# EAGLE design v1.1 Power (EAGLE 9.7.0)
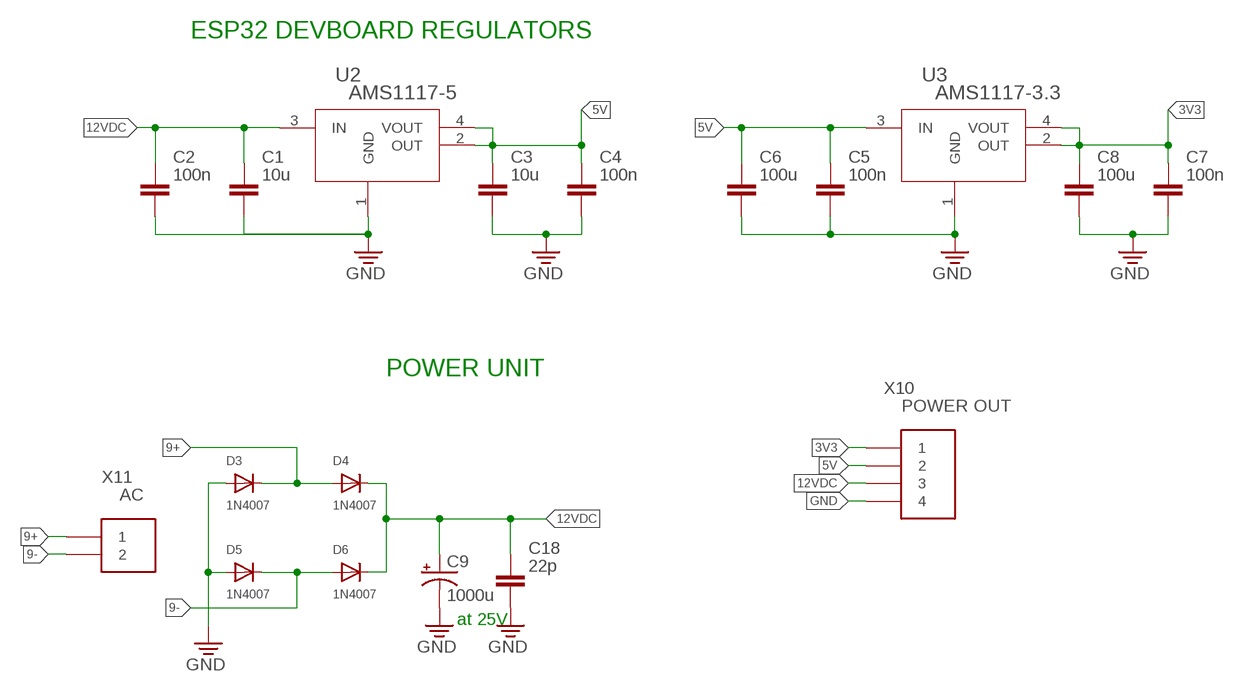
[diagram p0: schematic, sheet 1]

## Parts
C1  10u  C_CHIP-0805(2012-METRIC)  [CAPC2012X110]
C2  100n  C_CHIP-0805(2012-METRIC)  [CAPC2012X110]
C3  10u  C_CHIP-0805(2012-METRIC)  [CAPC2012X110]
C4  100n  C_CHIP-0805(2012-METRIC)  [CAPC2012X110]
C5  100n  C_CHIP-0805(2012-METRIC)  [CAPC2012X110]
C6  100u  C_CHIP-0805(2012-METRIC)  [CAPC2012X110]
C7  100n  C_CHIP-0805(2012-METRIC)  [CAPC2012X110]
C8  100u  C_CHIP-0805(2012-METRIC)  [CAPC2012X110]
C9  1000u  CAP_10X20INCAP_10X20IN  [CAP_10X20IN]
C18  22p  C_CHIP-0805(2012-METRIC)  [CAPC2012X110]
D3  1N4007  DIODE_SOD-123FL  [SOD-123FL]
D4  1N4007  DIODE_SOD-123FL  [SOD-123FL]
D5  1N4007  DIODE_SOD-123FL  [SOD-123FL]
D6  1N4007  DIODE_SOD-123FL  [SOD-123FL]
U2  AMS1117-5  AMS1117-5.0_AMS-L  [_AMS-L]
U3  AMS1117-3.3  AMS1117-3.3_ADS-L  [_ADS-L]
X10  POWER OUT  JST-XH-04-PIN-LONG-PAD  [JST-XH-04-PACKAGE-LONG-PAD]
X11  AC  JST-XH-02-PIN-LONG-PAD  [-LONG-PAD]

## Nets
3V3: C7.1 C8.1 U3.2(OUT) U3.4(VOUT) X10.1
5V: C3.1 C4.1 C5.1 C6.1 U2.2(OUT) U2.4(VOUT) U3.3(IN) X10.2
9+: D3.C D4.A X11.1
9-: D5.C D6.A X11.2
12VDC: C1.1 C2.1 C9.1(+) C18.1 D4.C D6.C U2.3(IN) X10.3
GND: C1.2 C2.2 C3.2 C4.2 C5.2 C6.2 C7.2 C8.2 C9.2(-) C18.2 D3.A D5.A U2.1(GND) U3.1(GND) X10.4

## Notes on the sheet
- ESP32 DEVBOARD REGULATORS
- POWER UNIT
- at 25V

## Library data of the parts
C1-C8 C18 = Capacitor:C: Capacitor - Generic; CATEGORY: Capacitor
C9 = SD-SolderSync-Library:CAP_10X20IN; COPYRIGHT: Copyright (C) 2025 Ultra Librarian. All rights reserved.; MANUFACTURER_PART_NUMBER: UVR1E102MPD; MFR_NAME: Nichicon
D3-D6 = adafruit:DIODE: Diode SMADIODE - SMA Surface Mount Package 20V 1A Schottky Diode Digikey: 641-1014-6-ND DO-1N4148 - Through Hole Small Current Diode SOD-123 20V 1 A (.5mV Vf) Schottky Diode - Digikey: MBRX120TPMSCT-ND SOD-323 10V 570mA (.38mV Vf, 3ns) Schottky Diode - Digikey: ZLLS410CT-ND SOD-523 30V 30mA Schottky Diode (RB751S-40TE61) - Digikey: RB751S-40TE61CT-ND SOT23-R/W - SOT23 Package (R = Solder Paste/Reflow Ovens, W = Hand-Soldering) BAT54Film 40V 300mA - Digikey: 497-7162-1-ND
U2 = SD-SolderSync-Library:AMS1117-5.0; COPYRIGHT: Copyright (C) 2024 Ultra Librarian. All rights reserved.; MANUFACTURER_PART_NUMBER: AMS1117-5.0; MFR_NAME: ams OSRAM
U3 = SD-SolderSync-Library:AMS1117-3.3; COPYRIGHT: Copyright (C) 2024 Ultra Librarian. All rights reserved.; MANUFACTURER_PART_NUMBER: AMS1117-3.3; MFR_NAME: Advanced Monolithic Systems
X10 = Connectors:JST-XH-04-PIN: JST XH Connector 2 Pin Wire to board connector. Pitch: 2,54 mm, (0.100") Number of pins: 4 Created by Rembrandt Electronics www.rembrandtelectronics.com
X11 = Connectors:JST-XH-02-PIN: JST XH Connector 2 Pin Wire to board connector. Pitch: 2,54 mm, (0.100") Number of pins: 2 Created by Rembrandt Electronics www.rembrandtelectronics.com

## Board
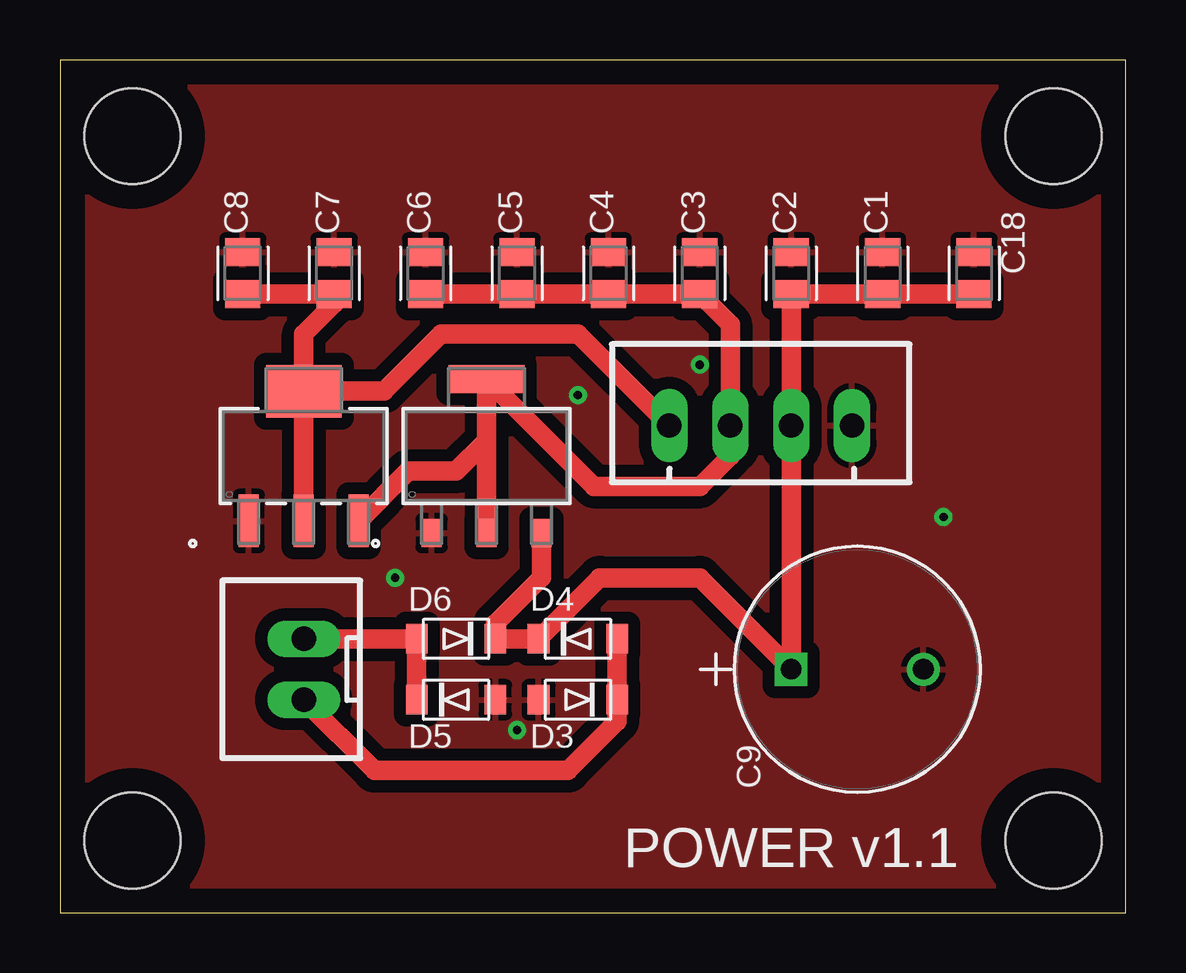
[diagram p1: board, top side]
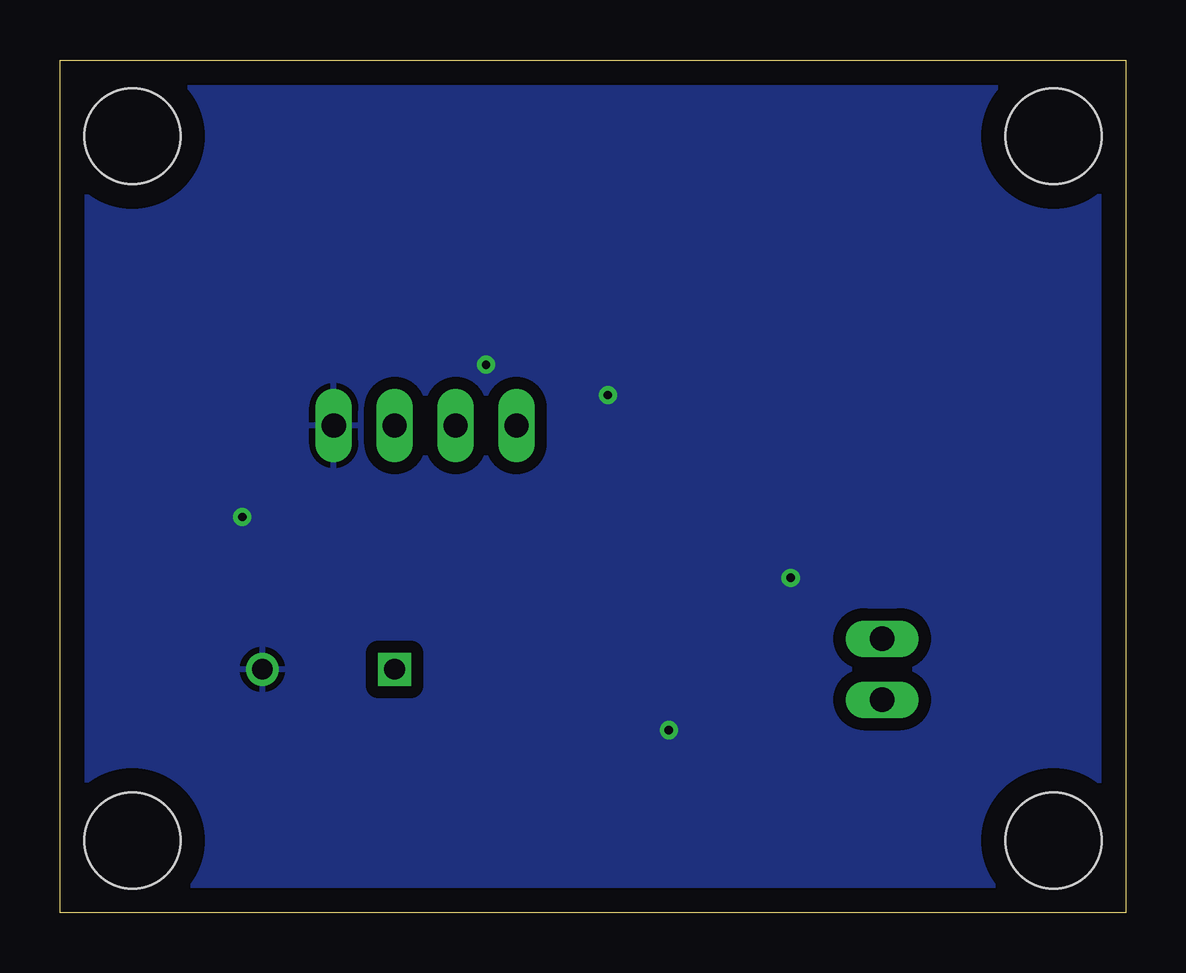
[diagram p2: board, bottom side, seen from below]

Size 44.43 x 35.56 mm. Coordinates in mm from the lower left corner, seen from the top.
Outline: 0,0 44.43,0 44.43,35.56 0,35.56 0,0
Copper layers (1*16): Top 0.035mm / dielectric 1.5mm / Bottom 0.035mm
Design rules "Fusion Electronics Design Rules": minimum track width 6mil, minimum drill 0.35mm, track to track 6mil, track to pad 6mil, pad to pad 6mil, via to via 6mil, smd to smd 6mil, copper to edge 40mil, drill to drill 6mil, minimum pad ring 10mil, minimum via ring 8mil, stop-mask expansion 4mil, vias tented up to drill 0mil, thermal gap 10mil
Holes 4 mm at 3.02,3.02 3.02,32.38 41.41,32.38 41.41,3.02

### Footprints (pad centres in the part's own frame; a part is rotated, then mirrored left to right if it is on the bottom)
CAPC2012X110 = smd 1.165 x 1.465: 1 -0.875,0; 2 0.875,0
CAP_10X20IN = drill 0.864 pad 1.372 square: 1 0,0 | drill 0.864 pad 1.372: 2 5.512,0
SOD-123FL = smd 0.91 x 1.22: A 1.637,0; C -1.637,0
_AMS-L = smd 0.838 x 1.168: 1 -2.29,-3.213; 2 0,-3.213; 3 2.29,-3.213 | smd 3.15 x 1.168: 4 0,3.213
_ADS-L = smd 0.838 x 2.184: 1 -2.29,-2.705; 2 0,-2.705; 3 2.29,-2.705 | smd 3.15 x 2.184: 4 0,2.705
JST-XH-04-PACKAGE-LONG-PAD = drill 1.016 long: 1 -3.81,0; 2 -1.27,0; 3 1.27,0; 4 3.81,0
-LONG-PAD = drill 1.016 long: 1 -1.27,0; 2 1.27,0

### Placement (x,y rotation side)
C1  34.29,26.67 90 top
C2  30.48,26.67 90 top
C3  26.67,26.67 90 top
C4  22.86,26.67 90 top
C5  19.05,26.67 90 top
C6  15.24,26.67 90 top
C7  11.43,26.67 90 top
C8  7.62,26.67 90 top
C9  30.48,10.16 0 top
C18  38.1,26.67 90 top
D3  21.59,8.89 180 top
D4  21.59,11.43 0 top
D5  16.51,8.89 0 top
D6  16.51,11.43 180 top
U2  17.78,19.05 0 top
U3  10.16,19.05 0 top
X10  29.21,20.32 0 top
X11  10.16,10.16 90 top

### Tracks (layer width: path | path; a pad name or v marks a point on that pad's centre or on a via)
3V3
  Top 0.254: C7.1 11.43,25.4
  Top 0.813: U3.4 13.5,21.75 15.88,24.13 21.59,24.13 X10.1 | C8.1 C7.1 | U3.4 10.16,24.13 11.43,25.4 | U3.4 U3.2
5V
  Top 0.254: C4.1 23.25,25.4
  Top 0.813: 17.78,19.68 U2.4 22.26,17.78 26.67,17.78 27.94,19.05 X10.2 27.94,24.52 C3.1 C4.1 C5.1 C6.1 | 17.78,19.68 U2.2 | U3.3 14.52,18.41 16.51,18.41 17.78,19.68
9+
  Top 0.813: D4.A D3.C 23.23,7.99 21.18,5.94 13.11,5.94 X11.1
9-
  Top 0.813: D5.C D6.A X11.2
12VDC
  Top 0.813: C18.1 C1.1 C2.1 X10.3 C9.1 26.67,13.97 22.49,13.97 D4.C D6.C 18.15,12.07 20.07,13.99 U2.3
GND  (via drill 0.35)
  Top 0.254: D5.A 18.46,8.89 18.5,8.94 | 19.6,8.94 19.64,8.89 D3.A | 38.49,27.54 C18.2
  other vias: 19.05,7.62 13.97,13.97 36.83,16.51 21.59,21.59 26.67,22.86
  pour Top (isolate 0.508): 2.59,-1.14 41.86,-1.14 45.59,2.59 45.59,32.97 41.86,36.7 2.59,36.7 -1.14,32.97 -1.14,2.59
  pour Bottom (isolate 0.508): 2.59,-2.41 41.86,-2.41 46.86,2.59 46.86,32.97 41.86,37.97 2.59,37.97 -2.41,32.97 -2.41,2.59

### Text on the board
tPlace: POWER v1.1